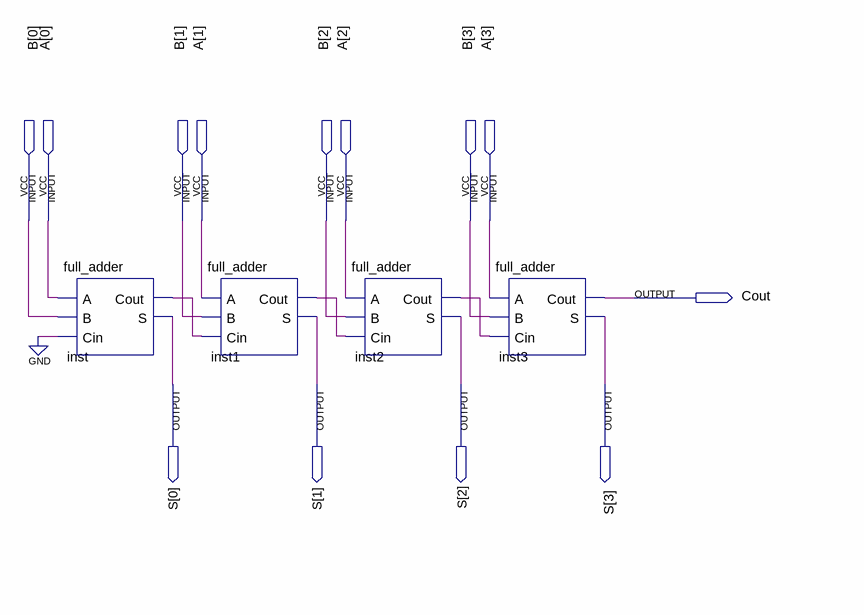
[diagram p0: schematic sheet]
// Quartus schematic binary_adder_4bit.bdf as structural Verilog: 4 symbols, 13 pins
module binary_adder_4bit (
  input  [3:0] B,
  input  [3:0] A,
  output Cout,
  output [3:0] S
);

  wire inst1_cout, inst2_cout, inst_cout;

  full_adder inst (.A(A[0]), .B(B[0]), .Cin(1'b0), .Cout(inst_cout), .S(S[0]));
  full_adder inst1 (.A(A[1]), .B(B[1]), .Cin(inst_cout), .Cout(inst1_cout), .S(S[1]));
  full_adder inst2 (.A(A[2]), .B(B[2]), .Cin(inst1_cout), .Cout(inst2_cout), .S(S[2]));
  full_adder inst3 (.A(A[3]), .B(B[3]), .Cin(inst2_cout), .Cout(Cout), .S(S[3]));
endmodule
